# EAGLE design item_2223_analog (EAGLE 9.6.2)
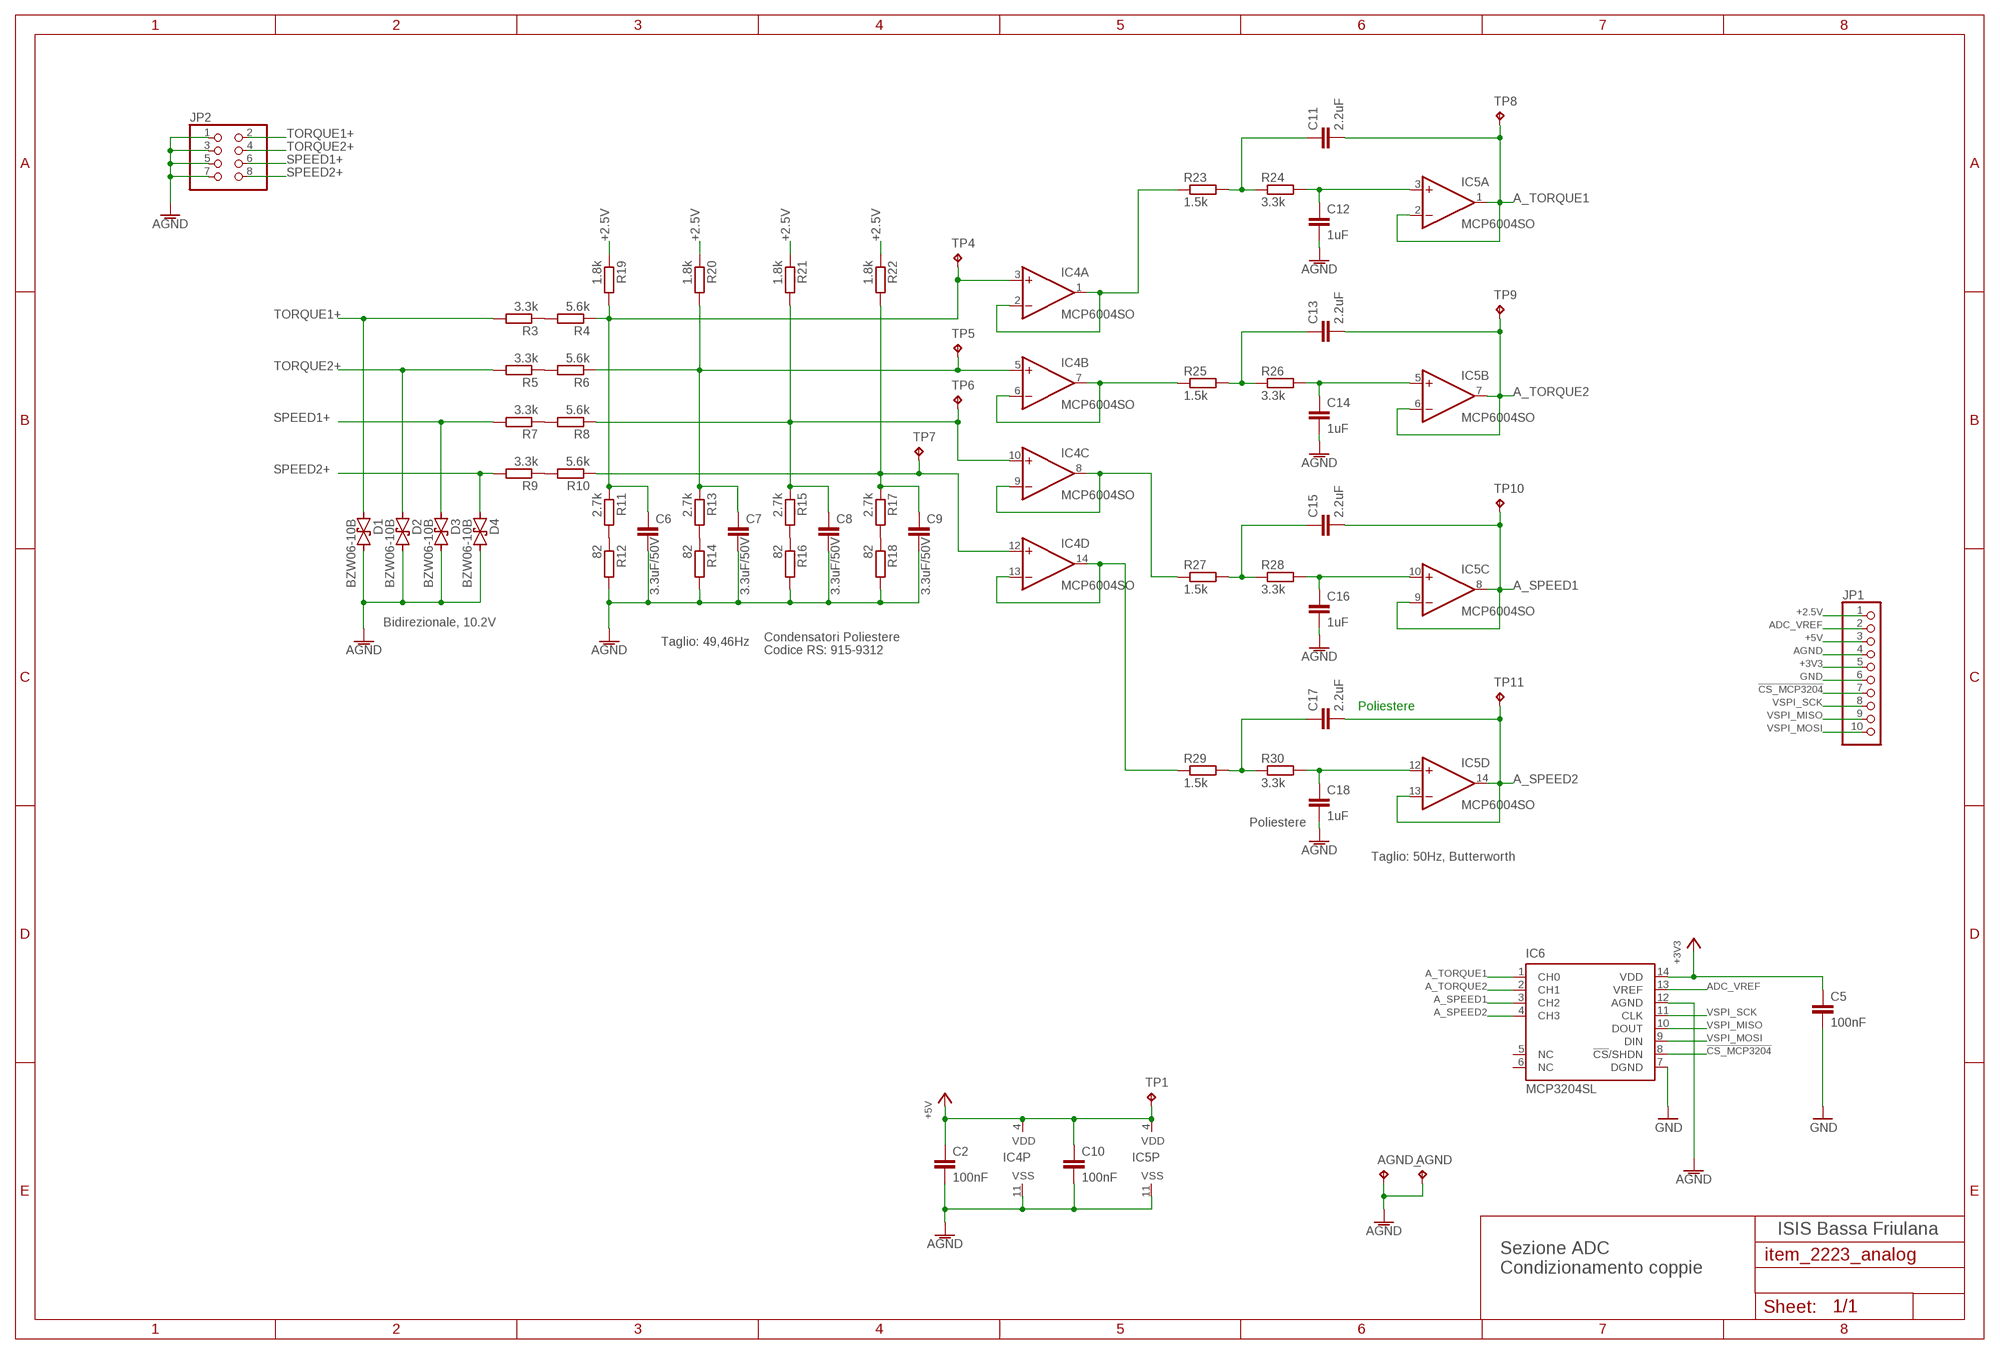
[diagram p0: schematic, sheet 1]

## Parts
AGND  TPTP18SQ  [TP18SQ]
AGND_  TPTP18SQ  [TP18SQ]
C2  100nF  C-EUC0805  [C0805]
C5  100nF  C-EUC0805  [C0805]
C6  3.3uF/50V  C-EUC0805  [C0805]
C7  3.3uF/50V  C-EUC0805  [C0805]
C8  3.3uF/50V  C-EUC0805  [C0805]
C9  3.3uF/50V  C-EUC0805  [C0805]
C10  100nF  C-EUC0805  [C0805]
C11  2.2uF  C-EUC0805  [C0805]
C12  1uF  C-EUC0805  [C0805]
C13  2.2uF  C-EUC0805  [C0805]
C14  1uF  C-EUC0805  [C0805]
C15  2.2uF  C-EUC0805  [C0805]
C16  1uF  C-EUC0805  [C0805]
C17  2.2uF  C-EUC0805  [C0805]
C18  1uF  C-EUC0805  [C0805]
D1  BZW06-10B  BZW04XXB  [F126Z12]
D2  BZW06-10B  BZW04XXB  [F126Z12]
D3  BZW06-10B  BZW04XXB  [F126Z12]
D4  BZW06-10B  BZW04XXB  [F126Z12]
IC4  MCP6004SO  [SO14]
IC5  MCP6004SO  [SO14]
IC6  MCP3204SL  [SO14]
JP1  PINHD-1X10  [1X10]
JP2  PINHD-2X4  [2X04]
R3  3.3k  R-EU_R0805  [R0805]
R4  5.6k  R-EU_R0805  [R0805]
R5  3.3k  R-EU_R0805  [R0805]
R6  5.6k  R-EU_R0805  [R0805]
R7  3.3k  R-EU_M0805  [M0805]
R8  5.6k  R-EU_R0805  [R0805]
R9  3.3k  R-EU_R0805  [R0805]
R10  5.6k  R-EU_R0805  [R0805]
R11  2.7k  R-EU_R0805  [R0805]
R12  82  R-EU_R0805  [R0805]
R13  2.7k  R-EU_R0805  [R0805]
R14  82  R-EU_R0805  [R0805]
R15  2.7k  R-EU_R0805  [R0805]
R16  82  R-EU_R0805  [R0805]
R17  2.7k  R-EU_R0805  [R0805]
R18  82  R-EU_R0805  [R0805]
R19  1.8k  R-EU_R0805  [R0805]
R20  1.8k  R-EU_R0805  [R0805]
R21  1.8k  R-EU_R0805  [R0805]
R22  1.8k  R-EU_R0805  [R0805]
R23  1.5k  R-EU_R0805  [R0805]
R24  3.3k  R-EU_R0805  [R0805]
R25  1.5k  R-EU_R0805  [R0805]
R26  3.3k  R-EU_R0805  [R0805]
R27  1.5k  R-EU_R0805  [R0805]
R28  3.3k  R-EU_R0805  [R0805]
R29  1.5k  R-EU_R0805  [R0805]
R30  3.3k  R-EU_R0805  [R0805]
TP1  TPTP16R  [TP16R]
TP4  TPTP14R  [TP14R]
TP5  TPTP14R  [TP14R]
TP6  TPTP14R  [TP14R]
TP7  TPTP14R  [TP14R]
TP8  TPTP14R  [TP14R]
TP9  TPTP14R  [TP14R]
TP10  TPTP14R  [TP14R]
TP11  TPTP14R  [TP14R]

## Nets
!CS_MCP3204! [digital]: IC6.8(!CS!/SHDN) JP1.7
+2.5V [supply]: JP1.1 R19.1 R20.1 R21.1 R22.1
+3V3 [supply]: C5.1 IC6.14(VDD) JP1.5
+5V [supply]: C2.1 C10.1 IC4.4(P:VDD) IC5.4(P:VDD) JP1.3 TP1.TP
A_SPEED1: C15.2 IC5.8(C:OUT) IC5.9(C:-IN) IC6.3(CH2) TP10.TP
A_SPEED2: C17.2 IC5.13(D:-IN) IC5.14(D:OUT) IC6.4(CH3) TP11.TP
A_TORQUE1: C11.2 IC5.1(A:OUT) IC5.2(A:-IN) IC6.1(CH0) TP8.TP
A_TORQUE2: C13.2 IC5.6(B:-IN) IC5.7(B:OUT) IC6.2(CH1) TP9.TP
ADC_VREF: IC6.13(VREF) JP1.2
AGND: AGND.TP AGND_.TP C2.2 C6.2 C7.2 C8.2 C9.2 C10.2 C12.2 C14.2 C16.2 C18.2 D1.C D2.C D3.C D4.C IC4.11(P:VSS) IC5.11(P:VSS) IC6.12(AGND) JP1.4 JP2.1 JP2.3 JP2.5 JP2.7 R12.2 R14.2 R16.2 R18.2
GND [supply]: C5.2 IC6.7(DGND) JP1.6
N$7: R3.1 R4.2
N$8: R5.1 R6.2
N$9: R7.1 R8.2
N$10: R9.1 R10.2
N$11: R11.2 R12.1
N$12: C6.1 IC4.3(A:+IN) R4.1 R11.1 R19.2 TP4.TP
N$13: R13.2 R14.1
N$14: R15.2 R16.1
N$15: R17.2 R18.1
N$16: C7.1 IC4.5(B:+IN) R6.1 R13.1 R20.2 TP5.TP
N$17: C8.1 IC4.10(C:+IN) R8.1 R15.1 R21.2 TP6.TP
N$18: C9.1 IC4.12(D:+IN) R10.1 R17.1 R22.2 TP7.TP
N$19: IC4.1(A:OUT) IC4.2(A:-IN) R23.1
N$20: IC4.6(B:-IN) IC4.7(B:OUT) R25.1
N$21: IC4.8(C:OUT) IC4.9(C:-IN) R27.1
N$22: IC4.13(D:-IN) IC4.14(D:OUT) R29.1
N$23: C11.1 R23.2 R24.1
N$24: C12.1 IC5.3(A:+IN) R24.2
N$26: C13.1 R25.2 R26.1
N$27: C14.1 IC5.5(B:+IN) R26.2
N$29: C15.1 R27.2 R28.1
N$30: C16.1 IC5.10(C:+IN) R28.2
N$32: C17.1 R29.2 R30.1
N$33: C18.1 IC5.12(D:+IN) R30.2
SPEED1+: D3.A JP2.6 R7.2
SPEED2+: D4.A JP2.8 R9.2
TORQUE1+: D1.A JP2.2 R3.2
TORQUE2+: D2.A JP2.4 R5.2
VSPI_MISO [digital]: IC6.10(DOUT) JP1.9
VSPI_MOSI [digital]: IC6.9(DIN) JP1.10
VSPI_SCK [digital]: IC6.11(CLK) JP1.8
Unconnected: IC6.5(NC) IC6.6(NC)

## Notes on the sheet
- Bidirezionale, 10.2V
- Taglio: 49,46Hz | Condensatori Poliestere
- Codice RS: 915-9312
- Poliestere
- Poliestere
- Taglio: 50Hz, Butterworth
- ISIS Bassa Friulana
- Sezione ADC
  Condizionamento coppie

## Library data of the parts
AGND AGND_ TP1 TP4-TP11 = testpad:TP: Test pad
C2 C5 C10 = rcl_LargePads:C-EU: CAPACITOR, European symbol
C6-C9 = rcl_LargePads:C-EU: CAPACITOR, European symbol; TME_EU: MKS2B043301H00KSSD
C11 C13 C15 C17 = rcl_LargePads:C-EU: CAPACITOR, European symbol; TME_EU: MKS2B042201F00KSSD
C12 C14 C16 C18 = rcl_LargePads:C-EU: CAPACITOR, European symbol; TME_EU: B32529C0105J189
D1-D4 = diode_LargePads:BZW04XXB: DIODE uni and bidirectional supressor diode
IC4 IC5 = MCP6002_MCP6004:MCP6004: MCP6004 - 1 MHz, Low-Power quad Op Amp, Rail-to-Rail Input/Output, Supply Voltage: 1.8V to 6.0V
IC6 = MCP3204_MCP3208:MCP3204: MCP3204 - 2.7V 4-Channel 12-Bit A/D Converters with SPI Serial Interface
JP1 = pinhead:PINHD-1X10: PIN HEADER
JP2 = pinhead:PINHD-2X4: PIN HEADER
R3-R30 = rcl_LargePads:R-EU_: RESISTOR, European symbol

## Net classes
0 default: width 0.305 mm, drill 0.254 mm, clearance 0.305 mm
1 supply: width 0.406 mm, drill 0.305 mm, clearance 0.356 mm to class 0, clearance 0.356 mm
2 digital: width 0.203 mm, drill 0.254 mm, clearance 0.254 mm to class 0, clearance 0.305 mm to class 1, clearance 0.203 mm

## Board
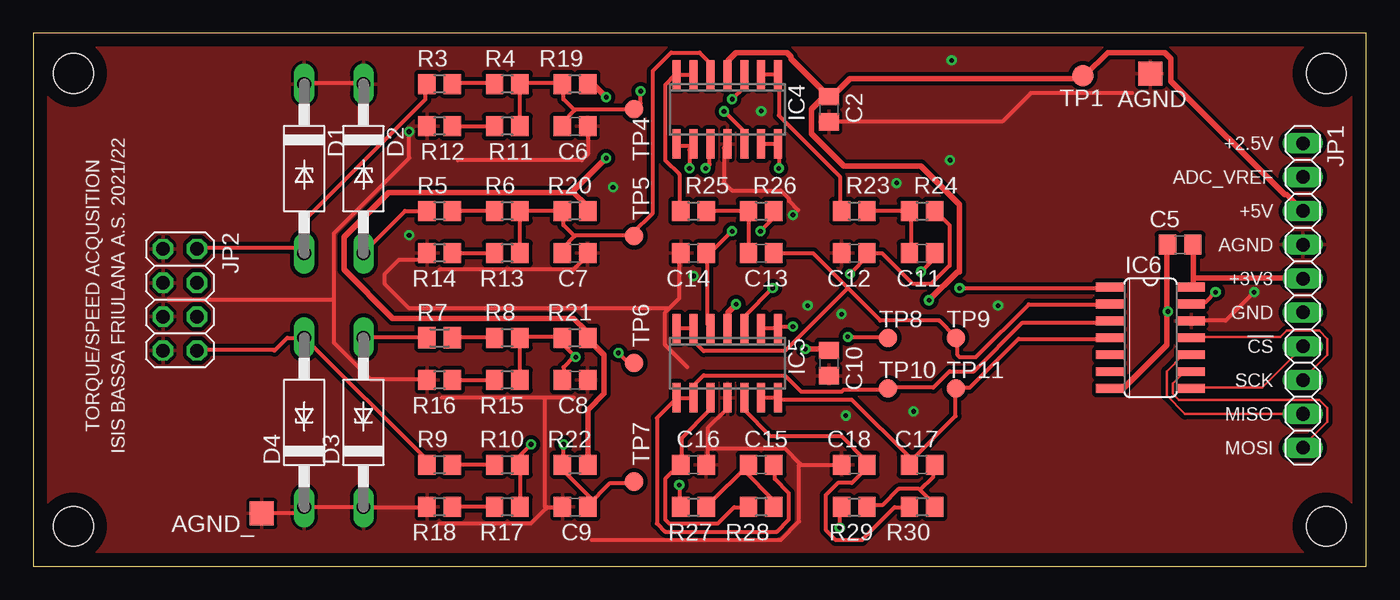
[diagram p1: board, top side]
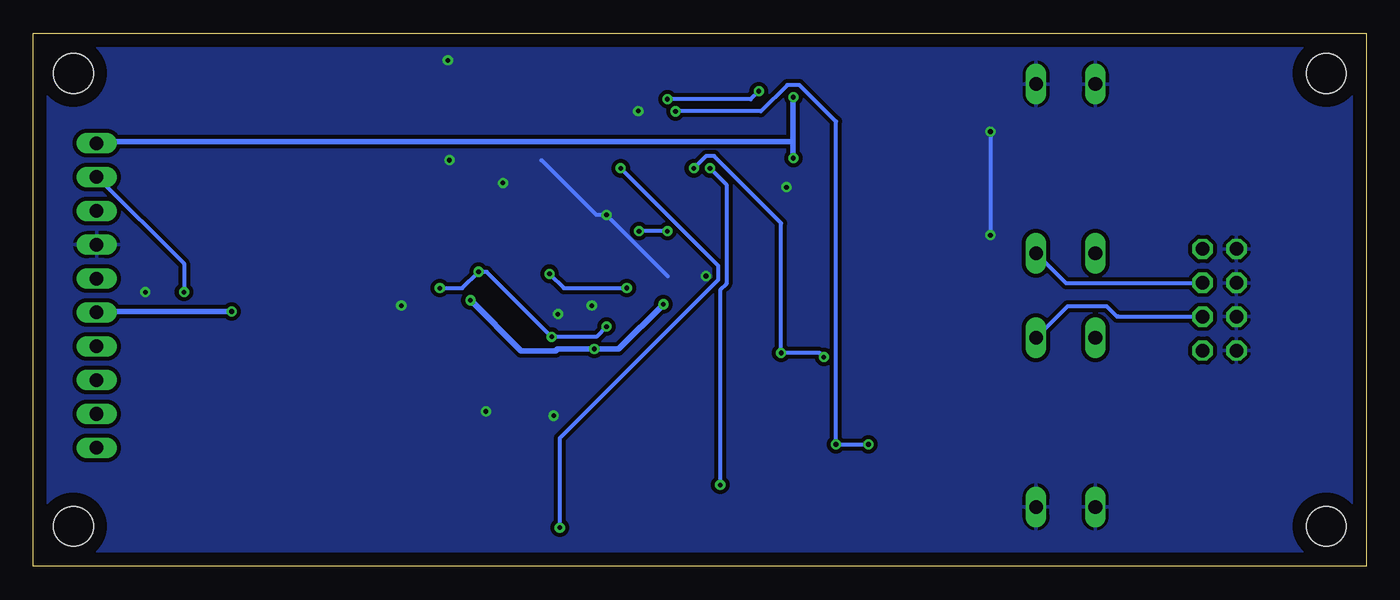
[diagram p2: board, bottom side, seen from below]

Size 100 x 40 mm. Coordinates in mm from the lower left corner, seen from the top.
Outline: 0,0 100,0 100,40 0,40 0,0
Copper layers (1*16): Top 0.035mm / dielectric 1.5mm / Bottom 0.035mm
Design rules "default": minimum track width 6mil, minimum drill 0.35mm, track to track 6mil, track to pad 6mil, pad to pad 6mil, via to via 6mil, smd to smd 6mil, copper to edge 40mil, drill to drill 6mil, minimum pad ring 10mil, minimum via ring 8mil, stop-mask expansion 4mil, vias tented up to drill 0mil, thermal gap 10mil
Holes 3 mm at 3,3 3,37 97,3 97,37

### Footprints (pad centres in the part's own frame; a part is rotated, then mirrored left to right if it is on the bottom)
TP18SQ = smd 1.8 x 1.8: TP 0,0
C0805 = smd 1.3 x 1.5: 1 -0.95,0; 2 0.95,0
F126Z12 = drill 1.016 long: A 6.35,0; C -6.35,0
SO14 = smd 0.6 x 2.2: 1 -3.81,-2.6; 2 -2.54,-2.6; 3 -1.27,-2.6; 4 0,-2.6; 5 1.27,-2.6; 6 2.54,-2.6; 7 3.81,-2.6; 8 3.81,2.6; 9 2.54,2.6; 10 1.27,2.6; 11 0,2.6; 12 -1.27,2.6; 13 -2.54,2.6; 14 -3.81,2.6
SO14' = smd 0.66 x 2.032: 1 -3.81,-3.073; 2 -2.54,-3.073; 3 -1.27,-3.073; 4 0,-3.073; 5 1.27,-3.073; 6 2.54,-3.073; 7 3.81,-3.073; 8 3.81,3.073; 9 2.54,3.073; 10 1.27,3.073; 11 0,3.073; 12 -1.27,3.073; 13 -2.54,3.073; 14 -3.81,3.073
1X10 = drill 1.016 long: 1 -11.43,0; 2 -8.89,0; 3 -6.35,0; 4 -3.81,0; 5 -1.27,0; 6 1.27,0; 7 3.81,0; 8 6.35,0; 9 8.89,0; 10 11.43,0
2X04 = drill 1.016 octagon: 1 -3.81,-1.27; 2 -3.81,1.27; 3 -1.27,-1.27; 4 -1.27,1.27; 5 1.27,-1.27; 6 1.27,1.27; 7 3.81,-1.27; 8 3.81,1.27
R0805 = smd 1.3 x 1.5: 1 -0.95,0; 2 0.95,0
M0805 = smd 1.3 x 1.6: 1 -0.95,0; 2 0.95,0
TP16R = smd 1.6 x 1.6: TP 0,0
TP14R = smd 1.4 x 1.4: TP 0,0

### Placement (x,y rotation side)
AGND  83.82,36.97 0 top
AGND_  17.14,3.95 0 top
C2  59.69,34.29 270 top
C5  86.04,24.13 180 top
C6  40.64,33.02 0 top
C7  40.64,23.5 0 top
C8  40.64,13.97 0 top
C9  40.64,4.45 180 top
C10  59.69,15.24 270 top
C11  66.67,23.5 0 top
C12  61.59,23.5 180 top
C13  54.61,23.5 0 top
C14  49.53,23.5 180 top
C15  54.61,7.62 0 top
C16  49.53,7.62 0 top
C17  66.67,7.62 180 top
C18  61.59,7.62 180 top
D1  20.32,29.84 270 top
D2  24.77,29.84 270 top
D3  24.77,10.79 90 top
D4  20.32,10.79 90 top
IC4  52.07,34.29 180 top
IC5  52.07,15.24 180 top
IC6  MCP3204SL  [SO14']  83.82,17.14 270 top
JP1  95.25,20.32 270 top
JP2  11,20 270 top
R3  30.48,36.2 180 top
R4  35.56,36.2 180 top
R5  30.48,26.67 180 top
R6  35.56,26.67 180 top
R7  30.48,17.14 180 top
R8  35.56,17.14 180 top
R9  30.48,7.62 180 top
R10  35.56,7.62 180 top
R11  35.56,33.02 180 top
R12  30.48,33.02 180 top
R13  35.56,23.5 180 top
R14  30.48,23.5 180 top
R15  35.56,13.97 180 top
R16  30.48,13.97 180 top
R17  35.56,4.45 180 top
R18  30.48,4.45 180 top
R19  40.64,36.2 180 top
R20  40.64,26.67 180 top
R21  40.64,17.14 180 top
R22  40.64,7.62 180 top
R23  61.59,26.67 0 top
R24  66.67,26.67 0 top
R25  49.53,26.67 0 top
R26  54.61,26.67 0 top
R27  49.53,4.45 0 top
R28  54.61,4.45 180 top
R29  61.59,4.45 0 top
R30  66.67,4.45 180 top
TP1  78.74,36.83 0 top
TP4  45.09,34.29 0 top
TP5  45.09,24.77 0 top
TP6  45.09,15.24 0 top
TP7  45.09,6.35 0 top
TP8  64.14,17.14 0 top
TP9  69.22,17.14 0 top
TP10  64.14,13.34 0 top
TP11  69.22,13.34 0 top

### Tracks (layer width: path | path; a pad name or v marks a point on that pad's centre or on a via)
!CS_MCP3204!
  Top 0.203: IC6.8 87.02,13.41 92.2,13.41 95.25,16.46 JP1.7
+2.5V  (via drill 0.35)
  Top 0.406: R22.1 41.6,7.62 41.6,11.73 42.82,12.95 42.82,15.85 41.6,17.07 R21.1 41.45,17.22 41.45,17.68 40.54,18.59 26.98,18.59 23.32,22.25 23.32,24.69 26.67,28.04 40.54,28.04 | 40.54,28.04 41.45,27.13 41.45,26.67 R20.1 | v42.98,35.2 42.06,36.12 41.6,36.12 R19.1 | v42.98,30.63 40.54,28.19 40.54,28.04
  Bottom 0.406: 95.25,31.7 JP1.1 95.12,31.88 43,31.88 | 43,31.88 43,30.75 v42.98,30.63 | 43,31.88 43,35.12 v42.98,35.2
+3V3
  Top 0.406: 87,20.83 IC6.14 87.02,21.03 87.02,21.64 | 87.02,21.64 87.02,24.08 C5.1 | 87.02,21.64 95.25,21.64 JP1.5
+5V  (via drill 0.35)
  Top 0.406: 78.72,36.7 TP1.TP | 78.87,36.7 TP1.TP | v57.91,16.31 59.59,16.31 C10.1 | v52.73,19.66 52.12,19.05 52.12,17.98 IC5.4 | C2.1 59.59,35.36 56.84,38.1 56.84,38.25 56.54,38.56 52.73,38.56 52.12,37.95 52.12,37.03 IC4.4 | C2.1 59.44,35.36 58.37,34.29 58.37,32.46 60.81,30.02 66.6,30.02 69.49,27.13 69.49,22.1 69.34,22.1 v67.21,19.96 | TP1.TP 78.64,36.58 61.27,36.58 59.89,35.2 C2.1 | JP1.3 94.03,27.89 93.88,27.89 85.34,36.42 85.34,38.1 84.89,38.56 80.62,38.56 78.94,36.88 TP1.TP
  Bottom 0.406: v52.73,19.66 56.08,16.31 v57.91,16.31 60.66,16.31 60.81,16.15 63.4,16.15 v67.21,19.96 67.36,19.96
A_SPEED1
  Top 0.305: 80.75,18.54 IC6.3 80.62,18.29 74.22,18.29 70.56,14.63 68.73,14.63 67.51,13.41 64.16,13.41 TP10.TP 64.01,13.26 60.81,13.26 60.66,13.11 57.61,13.11 56.39,14.33 50.29,14.33 49.53,13.56 IC5.9 | C15.2 55.63,7.62 55.63,6.55 56.69,5.49 56.69,3.5 55.78,2.59 47.4,2.59 46.79,3.2 46.79,11.12 48.16,12.5 IC5.8 48.31,12.65 IC5.9 | IC5.9
A_SPEED2
  Top 0.305: IC5.13 54.71,12.65 55.78,12.65 IC5.14 55.93,12.5 61.42,12.5 65.84,8.08 C17.2 65.84,7.62 65.84,7.92 69.19,11.28 69.19,13.26 TP11.TP 69.34,13.41 70.26,13.41 73.91,17.07 80.62,17.07 IC6.4 80.75,17.17
A_TORQUE1  (via drill 0.35)
  Top 0.305: v61.11,17.22 64.01,17.22 TP8.TP | v57,17.98 55.93,17.98 IC5.1 55.78,17.83 54.71,17.83 IC5.2 | v66.6,22.1 67.51,23.01 67.51,23.47 C11.2 | 80.62,20.88 IC6.1 80.5,20.88 v69.5,20.88
  Bottom 0.305: v57,17.98 57.76,17.22 v61.11,17.22 65.99,22.1 v66.6,22.1 67.82,20.88 v69.5,20.88
A_TORQUE2
  Top 0.305: IC5.6 48.31,17.83 IC5.7 | 80.75,19.76 IC6.2 80.62,19.66 74.68,19.66 70.71,15.7 69.49,15.7 69.34,15.85 69.34,17.07 TP9.TP 69.19,17.22 67.97,18.44 63.55,18.44 61.11,20.88 | 61.11,20.88 58.52,23.47 55.63,23.47 C13.2 | IC5.6 49.53,16.92 50.29,16.15 56.39,16.15 61.11,20.88 | IC5.6
ADC_VREF  (via drill 0.35)
  Top 0.305: v88.7,20.57 87.94,19.81 87.02,19.81 IC6.13
  Bottom 0.305: v88.7,20.57 88.7,22.71 95.25,29.26 JP1.2
AGND  (via drill 0.35)
  Top 0.305: v91.59,20.57 89.46,18.44 87.02,18.44 IC6.12 | 82.45,35.51 74.83,35.51 72.69,33.38 59.74,33.38 C2.2 | 94.79,24.23 95.25,24.23 JP1.4 | 60.5,23.62 C12.2 | IC4.11 51.97,31.55 51.82,31.39 51.82,28.8 52.43,28.19 56.08,28.19 56.69,27.58 56.69,27.43 57.38,26.75 v57,26.36 | 29.57,23.16 29.57,23.47 R14.2 29.57,23.01 27.43,23.01 26.36,21.95 26.36,21.18 28.19,19.36 47.55,19.36 47.62,19.28 | 30.48,22.25 40.54,22.25 41.45,23.16 41.45,23.47 | 47.62,19.28 47.4,19.05 47.4,16.61 49.07,14.94 | 47.62,19.28 48.46,20.12 48.46,21.78 48.46,23.47 C14.2 | D1.C 20.42,36.27 24.69,36.27 D2.C | 31.85,30.48 41.15,30.48 41.6,30.94 41.6,32.92 C6.2 | 29.57,32.92 R12.2 29.41,32.92 | 50.6,8.84 50.6,10.36 51.97,11.73 51.97,12.5 IC5.11 | 50.6,8.84 50.6,7.62 C16.2 | C18.2 57.61,7.62 57.53,7.7 | 57.53,7.7 56.39,8.84 50.6,8.84 | 40.54,12.65 38.41,12.65 | 38.41,12.65 30.63,12.65 | 41.45,13.56 41.45,13.87 C8.2 | AGND_.TP 17.22,3.96 19.81,3.96 20.27,4.42 D4.C 20.42,4.42 24.69,4.42 D3.C 24.84,4.42 29.41,4.42 R18.2 | 38.48,4.34 37.34,3.2 30.48,3.2 | 38.48,4.34 38.56,4.42 39.62,4.42 C9.2 39.62,4.27 | 38.41,12.65 38.41,4.42 38.48,4.34 | 41.91,1.98 56.08,1.98 57.45,3.35 57.45,7.62 57.53,7.7 | v28.19,32.61 28.19,30.63 22.55,24.99 22.55,20 | 22.55,20 22.55,16.76 25.3,14.02 29.41,14.02 R16.2 | 10.25,16.25 JP2.7 | 10.25,18.62 JP2.5 10.12,18.88 | 10.12,21.25 JP2.3 10.25,21.38 | 10.25,23.75 JP2.1 | 22.55,20 10.12,20
  Bottom 0.305: 95.25,24.23 JP1.4 | 52.41,21.78 v57,26.36 57.76,26.36 61.87,30.48 | 28.19,32.77 v28.19,32.61 v28.19,24.84
  other vias: 49.53,21.78 68.78,30.48 43.5,28.45 58.1,19.56 72.39,19.56 66.04,11.62 54.61,34.16 68.9,37.97 64.77,28.77 60.64,18.92 60.96,11.3
  pour Top: -0.95,40.64 101.28,40.64 101.28,-1.27 -1.27,-1.27 -1.27,40.64
  pour Bottom: -1.27,41.91 101.6,41.91 101.6,-1.59 -1.27,-1.59 -1.27,41.59
GND  (via drill 0.35)
  Top 0.406: 85.04,19.12 85.04,16.61 81.84,13.41 80.77,13.41 IC6.7 80.62,13.26 | 85.04,19.12 85.04,24.08 C5.2 | v85.12,19.12 85.04,19.12
  Bottom 0.406: v85.12,19.12 95.25,19.12 JP1.6
N$7
  Top 0.305: R3.1 31.55,36.27 34.59,36.27 R4.2
N$8
  Top 0.305: R6.2 R5.1
N$9
  Top 0.305: R8.2 34.59,17.22 31.55,17.22 R7.1
N$10
  Top 0.305: R10.2 R9.1
N$11
  Top 0.305: R12.1 R11.2
N$12  (via drill 0.35)
  Top 0.305: 36.42,36.12 R4.1 36.58,36.27 | 40.62,34.21 39.78,33.38 39.78,33.07 C6.1 | 40.62,34.21 40.69,34.29 TP4.TP 45.11,34.29 45.57,34.75 v45.57,35.66 | 40.62,34.21 39.78,35.05 39.78,36.12 R19.2 39.62,36.27 36.58,36.27 | IC4.3 53.34,35.97 v52.43,35.05 | R11.1 R4.1 36.58,36.27
  Bottom 0.305: v52.43,35.05 46.18,35.05 v45.57,35.66
N$13
  Top 0.305: R14.1 R13.2
N$14
  Top 0.305: R16.1 R15.2
N$15
  Top 0.305: R17.2 R18.1
N$16
  Top 0.305: 40.62,24.77 40.69,24.84 44.96,24.84 TP5.TP 44.96,24.99 46.48,26.52 46.48,37.19 47.85,38.56 49.99,38.56 50.75,37.8 50.75,37.03 IC4.5 | 40.62,24.77 39.78,25.6 39.78,26.67 R20.2 R6.1 36.42,26.67 36.51,26.58 R13.1 | C7.1 39.69,23.84 40.62,24.77
N$17  (via drill 0.35)
  Top 0.305: TP6.TP 44.65,15.24 v43.89,16 | C8.1 39.78,14.02 39.78,14.94 40.54,15.7 v40.69,15.7 39.78,16.61 39.78,17.07 R21.2 39.62,17.22 36.58,17.22 R8.1 36.42,17.07 36.51,16.98 R15.1 | v50.44,29.87 50.75,30.18 50.75,31.55 IC4.10
  Bottom 0.305: v40.69,15.7 41,16 v43.89,16 43.89,25.76 48.92,30.79 49.53,30.79 v50.44,29.87
N$18  (via drill 0.35)
  Top 0.305: 36.42,7.62 R10.1 | TP7.TP 44.96,6.25 43.28,6.25 41.6,4.57 C9.1 41.91,5.03 39.78,7.16 39.78,7.62 | IC4.12 53.34,32.61 v51.82,34.14 | 39.78,7.62 v39.78,9.14 | 39.78,7.62 R22.2 | v37.34,9.14 36.58,8.38 36.58,7.62 R10.1 | R10.1 R17.1
  Bottom 0.305: v51.82,34.14 45.41,34.14 43.43,36.12 42.52,36.12 39.78,33.38 v39.78,9.14 v37.34,9.14
N$19
  Top 0.305: R23.1 60.5,26.67 60.5,29.26 55.93,33.83 55.93,36.88 IC4.1 55.78,36.88 54.71,36.88 IC4.2
N$20
  Top 0.305: R25.1 48.46,26.67 48.46,29.41 47.4,30.48 47.4,36.12 48.16,36.88 IC4.7 48.31,36.88 IC4.6
N$21  (via drill 0.35)
  Top 0.305: v48.46,6.1 48.46,4.57 R27.1 | v49.23,29.87 49.23,31.24 49.53,31.55 IC4.9 49.38,31.55 48.31,31.55 IC4.8
  Bottom 0.305: v48.46,6.1 48.46,20.73 48.01,21.18 48.01,28.65 v49.23,29.87
N$22  (via drill 0.35)
  Top 0.305: v60.5,2.9 60.5,4.42 R29.1 | v55.93,29.87 55.93,31.55 IC4.14 55.78,31.7 54.71,31.7 IC4.13
  Bottom 0.305: v60.5,2.9 60.5,9.6 48.62,21.49 48.62,22.55 v55.93,29.87
N$23
  Top 0.305: R23.2 R24.1 65.84,26.67 65.84,23.62 C11.1
N$24  (via drill 0.35)
  Top 0.305: R24.2 67.67,26.67 68.73,25.6 68.73,22.55 67.36,21.18 65.99,21.18 63.7,23.47 62.64,23.47 C12.1 62.64,23.32 v61.27,21.95 | IC5.3 53.34,18.75 v55.47,20.88
  Bottom 0.305: v55.47,20.88 60.2,20.88 v61.27,21.95
N$26
  Top 0.305: 53.65,26.67 53.65,23.62 C13.1 | 53.65,26.67 R25.2 | 53.65,26.67 R26.1
N$27  (via drill 0.35)
  Top 0.305: IC5.5 50.75,17.98 50.6,18.14 50.6,23.47 C14.1 50.75,23.47 v52.43,25.15 | v54.56,25.15 55.47,26.06 55.47,26.67 R26.2
  Bottom 0.305: v52.43,25.15 v54.56,25.15
N$29
  Top 0.305: R27.2 50.6,4.57 53.65,7.62 C15.1 53.34,7.16 55.47,5.03 55.47,4.57 R28.1
N$30
  Top 0.305: IC5.10 50.75,12.5 50.75,11.73 48.62,9.6 48.62,7.62 C16.1 48.46,7.62 47.4,6.55 47.4,3.5 47.7,3.2 51.36,3.2 52.58,4.42 53.65,4.42 R28.2
N$32
  Top 0.305: 66.52,5.71 67.67,4.57 R30.1 | 66.52,5.71 66.45,5.79 64.92,5.79 63.7,4.57 62.64,4.57 R29.2 | 66.52,5.71 67.51,6.71 67.51,7.62 C17.1
N$33
  Top 0.305: 62.48,7.62 62.48,7.32 61.42,6.25 60.35,6.25 59.44,5.33 59.44,2.74 60.2,1.98 62.18,1.98 64.62,4.42 65.68,4.42 R30.2 | IC5.12 53.34,11.73 55.32,9.75 60.66,9.75 62.48,7.92 62.48,7.62 | 62.48,7.62 C18.1
SPEED1+
  Top 0.305: R7.2 29.41,17.22 24.84,17.22 D3.A
  Bottom 0.305: D3.A 22.39,19.52 19.49,19.52 18.7,18.73 18.62,18.75 12.75,18.75 JP2.6
SPEED2+
  Top 0.305: R9.2 29.41,7.62 29.41,8.08 20.42,17.07 D4.A 20.27,17.07 20.19,17.14 19.05,17.14 18.09,16.19 18,16.25 12.75,16.25 JP2.8
TORQUE1+
  Top 0.305: 20.42,23.77 20.42,23.62 D1.A | 20.42,23.77 20.42,26.06 29.41,35.05 29.41,36.12 R3.2 | 20.42,23.77 20.39,23.67 | 20.39,23.67 D1.A | 20.25,23.81 20.39,23.67 | JP2.2 12.75,23.88 20.12,23.88 D1.A
TORQUE2+
  Top 0.305: R5.2 27.89,26.67 24.84,23.62 D2.A
  Bottom 0.305: 24.69,23.62 D2.A 22.54,21.27 22.5,21.25 12.75,21.25 JP2.4
VSPI_MISO
  Top 0.203: JP1.9 86.41,11.43 85.04,12.8 85.04,14.63 86.26,15.85 86.87,15.85 IC6.10
VSPI_MOSI
  Top 0.203: IC6.9 86.87,14.48 86.26,14.48 85.5,13.72 85.5,12.95 85.95,12.5 96.47,12.5 97.08,11.89 97.08,10.82 95.25,8.99 JP1.10
VSPI_SCK
  Top 0.203: IC6.11 87.02,17.22 93.57,17.22 94.03,17.68 96.47,17.68 97.08,17.07 97.08,15.85 95.25,14.02 JP1.8

### Text on the board
tNames: +2.5V | ADC_VREF | +5V | AGND | +3V3 | TORQUE/SPEED ACQUSITION | ISIS BASSA FRIULANA A.S. 2021/22 | GND | !CS! | SCK | MISO | MOSI